# Altium project ESP32.PrjPcb
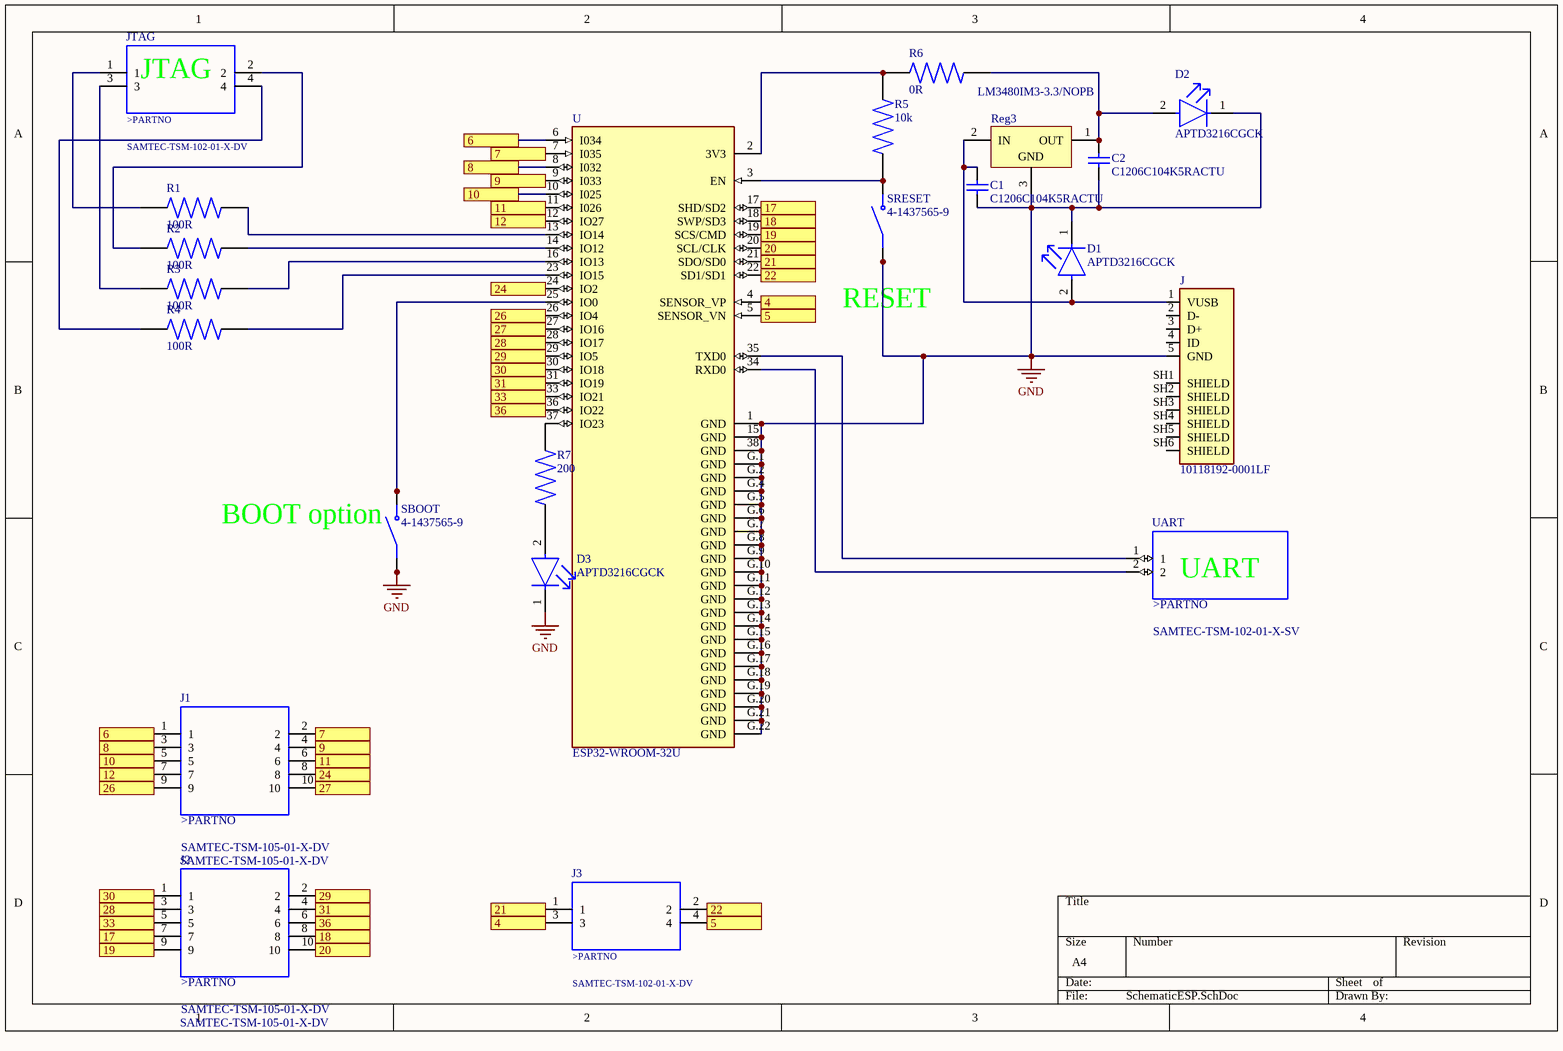
[diagram p0: SchematicESP.SchDoc]
1 sheet, 22 parts. Net scope: flat (ports and power ports of the same name join across sheets).
Board file: PCB1.PcbDoc

## Sheet SchematicESP.SchDoc
size A4; SheetNumber: 1; SheetTotal: 1

### Parts
C1  C1206C104K5RACTU  [KEMT-1206-2_M]
C2  C1206C104K5RACTU  [KEMT-1206-2_M]
D1  APTD3216CGCK  [FP-APTD3216CGCK-MFG]
D2  APTD3216CGCK  [FP-APTD3216CGCK-MFG]
D3  APTD3216CGCK  [FP-APTD3216CGCK-MFG]
J  10118192-0001LF  [AMPHENOL_10118192-0001LF]
J1  SAMTEC-TSM-105-01-X-DV  [SAMTEC-TSM-105-01-X-DV]
J2  SAMTEC-TSM-105-01-X-DV  [SAMTEC-TSM-105-01-X-DV]
J3  (no value)  [SAMTEC-TSM-102-01-X-DV]
JTAG  (no value)  [SAMTEC-TSM-102-01-X-DV]
R1  100R  [RESC3116X65N]
R2  100R  [RESC3116X65N]
R3  100R  [RESC3116X65N]
R4  100R  [RESC3116X65N]
R5  10k  [RESC3116X65N]
R6  0R  [RESC3116X65N]
R7  200  [RESC3116X65N]
Reg3  LM3480IM3-3.3/NOPB  [DBZ0003A_M]
SBOOT  4-1437565-9  [SW_4-1437565-9]
SRESET  4-1437565-9  [SW_4-1437565-9]
U  ESP32-WROOM-32U  [XCVR_ESP32-WROOM-32U]
UART  (no value)  [SAMTEC-TSM-102-01-X-SV]

### Ports
4, 5, 6, 7, 8, 9, 10, 11, 12, 17, 18, 19, 20, 21, 22, 24, 26, 27, 28, 29, 30, 31, 33, 36

### Nets
GND: C1.1 C2.1 D1.1(C) D2.1(C) D3.1(C) J.5(GND) Reg3.3(GND) SBOOT.1(COM) SBOOT.2(COM) SRESET.1(COM) SRESET.2(COM) U.1(GND) U.15(GND) U.38(GND) U.G.1(GND) U.G.2(GND) U.G.4(GND) U.G.5(GND) U.G.6(GND) U.G.7(GND) U.G.8(GND) U.G.9(GND) U.G.10(GND) U.G.11(GND) U.G.12(GND) U.G.13(GND) U.G.14(GND) U.G.15(GND) U.G.16(GND) U.G.17(GND) U.G.18(GND) U.G.19(GND) U.G.20(GND) U.G.21(GND) U.G.22(GND)
NetC1_2: C1.2 D1.2(A) J.1(VUSB) Reg3.2(IN)
NetC2_2: C2.2 D2.2(A) R6.1 Reg3.1(OUT)
NetD3_2: D3.2(A) R7.1
NetJ1_1: J1.1 U.6(I034) ; port 6
NetJ1_2: J1.2 U.7(I035) ; port 7
NetJ1_3: J1.3 U.8(I032) ; port 8
NetJ1_4: J1.4 U.9(I033) ; port 9
NetJ1_5: J1.5 U.10(I025) ; port 10
NetJ1_6: J1.6 U.11(I026) ; port 11
NetJ1_7: J1.7 U.12(IO27) ; port 12
NetJ1_8: J1.8 U.24(IO2) ; port 24
NetJ1_9: J1.9 U.26(IO4) ; port 26
NetJ1_10: J1.10 U.27(IO16) ; port 27
NetJ2_1: J2.1 U.30(IO18) ; port 30
NetJ2_2: J2.2 U.29(IO5) ; port 29
NetJ2_3: J2.3 U.28(IO17) ; port 28
NetJ2_4: J2.4 U.31(IO19) ; port 31
NetJ2_5: J2.5 U.33(IO21) ; port 33
NetJ2_6: J2.6 U.36(IO22) ; port 36
NetJ2_7: J2.7 U.17(SHD/SD2) ; port 17
NetJ2_8: J2.8 U.18(SWP/SD3) ; port 18
NetJ2_9: J2.9 U.19(SCS/CMD) ; port 19
NetJ2_10: J2.10 U.20(SCL/CLK) ; port 20
NetJ3_1: J3.1 U.21(SDO/SD0) ; port 21
NetJ3_2: J3.2 U.22(SD1/SD1) ; port 22
NetJ3_3: J3.3 U.4(SENSOR_VP) ; port 4
NetJ3_4: J3.4 U.5(SENSOR_VN) ; port 5
NetJTAG_1: JTAG.1 R1.2
NetJTAG_2: JTAG.2 R2.2
NetJTAG_3: JTAG.3 R3.2
NetJTAG_4: JTAG.4 R4.2
NetR1_1: R1.1 U.13(IO14)
NetR2_1: R2.1 U.14(IO12)
NetR3_1: R3.1 U.16(IO13)
NetR4_1: R4.1 U.23(IO15)
NetR5_1: R5.1 SRESET.3(NO) SRESET.4(NO) U.3(EN)
NetR5_2: R5.2 R6.2 U.2(3V3)
NetR7_2: R7.2 U.37(IO23)
NetSBOOT_3: SBOOT.3(NO) SBOOT.4(NO) U.25(IO0)
NetU_34: U.34(RXD0) UART.2
NetU_35: U.35(TXD0) UART.1

Not connected (* = marked no-connect by the designer): J 2(D-) 3(D+) 4(ID) SH1(SHIELD) SH2(SHIELD) SH3(SHIELD) SH4(SHIELD) SH5(SHIELD) SH6(SHIELD)

### Notes on the sheet
- (near JTAG) JTAG
- (near SRESET) RESET
- (near SBOOT) BOOT option
- (near UART) UART
- (in symbol SAMTEC-TSM-102-01-X-DV) >PARTNO
- (in symbol SAMTEC-TSM-102-01-X-SV) >PARTNO
- (in symbol SAMTEC-TSM-105-01-X-DV) >PARTNO

### Library data of the parts
C1 C2 = CMP-1037-04202-2: CAP, Ceramic, 0.1 uF, +/- 10%, 50 V, -55 to 125 degC, 1206 (3216 Metric), RoHS, Tape and Reel; Manufacturer: Kemet; Voltage Rating: 50V; Capacitance: 0.1µF; Product Range: KEMET-CSeries; SVHC: ToBeAdvised; Dielectric Characteristic: X7R; Capacitor Case Style: 1206[3216Metric]; Package Reference: 1206-2; Package Description: 2-Leads SMD, Body 3.2 x 1.6 mm; Packaging: Tape&Reel; Operating Temperature Max: 125degC; Capacitance Tolerance: ±10%; Datasheet URL: https://datasheet.ciiva.com/6125/1725438-6125494.pdf; Manufacturer URL: http://www.kemet.com/; Operating Temperature Min: -55degC; Datasheet Version: Jul-13
D1-D3 = CMP-2000-05792-2: LED GREEN CLEAR 2SMD; Forward Voltage: 2.1V; Forward Current: 20mA; Luminous Intensity: 300mcd; Number of LEDs: 1; Dominant Wavelength: 570nm; Viewing Angle: 50°; Lead Free: Lead Free; Lens Color: Clear; Mount: Surface Mount; Package Quantity: 2000; Height: 1.8mm; Number of Pins: 2; Test Current: 20mA; Case Code (Metric): 3216; Case/Package: 1206; Case Code (Imperial): 1206; Illumination Color: Green; Color: Green; Width: 1.6mm; Packaging: Tape and Reel; Min Operating Temperature: -40°C; Lens Style: Clear; Max Operating Temperature: 85°C; Length: 3.2mm
J = 10118192-0001LF: USB - micro B USB 2.0 Receptacle Connector 5 Position Surface Mount, Right Angle; MF: Amphenol ICC; Availability: Unavailable; Price: None; Package: None; MP: 10118192-0001LF; Value: *; SnapEDA_Link: https://www.snapeda.com/parts/10118192-0001LF/Amphenol%20FCI/view-part/2897676/?ref=snap
J1 J2 = SAMTEC-TSM-105-01-X-DV: TSM Series .100 Surface Mount Terminal Strip; MF: Samtec Inc.; MP: TSM-105-01-F-DV; Digi-Key_Purchase_URL: https://www.digikey.com/product-detail/en/samtec-inc/TSM-105-01-F-DV-001/TSM-105-01-F-DV-001-ND/7637717?utm_source=snapeda&utm_medium=aggregator&utm_campaign=symbol; Digi-Key_Part_Number: TSM-105-01-F-DV-001-ND; SnapEDA_Link: https://www.snapeda.com/parts/TSM-105-01-F-DV/Samtec%20Inc./view-part/2802977/?ref=snap; Package: None; Value: *
J3 JTAG = SAMTEC-TSM-102-01-X-DV: TSM Series .100 Surface Mount Terminal Strip; MF: Samtec; MP: TSM-102-01-F-DV; Value: *; SnapEDA_Link: https://www.snapeda.com/parts/TSM-102-01-F-DV/Samtec%20Inc./view-part/2805976/?ref=snap; Package: None; Digi-Key_Part_Number: TSM-102-01-F-DV-ND; Digi-Key_Purchase_URL: https://www.digikey.com/product-detail/en/samtec-inc/TSM-102-01-F-DV/TSM-102-01-F-DV-ND/7623428?utm_source=snapeda&utm_medium=aggregator&utm_campaign=symbol
R1-R7 = RC1206JR-0713RL: 13 Ohms Â±5% 0.25W, 1/4W Chip Resistor 1206 _3216 Metric_ Moisture Resistant Thick Film; MF: Yageo; MP: RC1206JR-0713RL; Availability: Unavailable; SnapEDA_Link: https://www.snapeda.com/parts/RC1206JR-0713RL/Yageo/view-part/105893/?ref=snap; Package: 3116 Yageo; Value: *; Price: None
Reg3 = CMP-0062-02202-3: 100 mA, Quasi Low-Dropout Linear Voltage Regulator, 3-pin SOT-23, Pb-Free; Manufacturer: Texas Instruments; CompType: LDO IC; PackageTopMarking: L0A*XTT; PowerWise: N; PackageDescription: Molded SOT-23, .115 x .051 x .037in Body, 3 Lead, .075 in Pitch; PackageReference: DBZ0003A; RoHS: Y; ComponentLink1URL: http://www.ti.com/general/docs/lit/getliterature.tsp?genericPartNumber=LM3480&fileType=pdf; PinCount: 3; ComponentLink1Description: Datasheet URL
SBOOT SRESET = 4-1437565-9: Tactile Switch SPST-NO Top Actuated Surface Mount; Configuration_Pole-Throw: Single Pole - Single Throw; Contact_Current_Rating: 50 mA; MF: TE Connectivity; Availability: Warning; Value: *; Package: None; Price: None; SnapEDA_Link: https://www.snapeda.com/parts/4-1437565-9/TE%20Connectivity%20ALCOSWITCH%20Switches/view-part/304397/?ref=snap; Purchase-URL: https://pricing.snapeda.com/search/part/4-1437565-9/?ref=eda; MP: 4-1437565-9; EU_RoHS_Compliance: Compliant
U = ESP32-WROOM-32U: Bluetooth, WiFi 802.11b/g/n, Bluetooth v4.2 +EDR, Class 1, 2 and 3 Transceiver Module 2.4GHz ~ 2.5GHz Antenna Not Included, U.FL Surface Mount; MF: Espressif Systems; Value: *; SnapEDA_Link: https://www.snapeda.com/parts/ESP32-WROOM-32U/Espressif%20Systems/view-part/2472476/?ref=snap; Availability: Unavailable; Price: None; DigiKey-Purchase-URL: https://snapeda.com/shop?store=DigiKey&id=2472476; Package: Module Espressif Systems; MP: ESP32-WROOM-32U
UART = SAMTEC-TSM-102-01-X-SV: Steckverbinder-Header-OberflÃ¤chenmontage 2 Position 2,54 mm (0,100 ); MF: Samtec; MP: TSM-102-01-T-SV-TR; Toby_UK-Purchase-URL: https://snapeda.com/shop?store=Toby+UK&id=2803555; Package: None; SnapEDA_Link: https://www.snapeda.com/parts/TSM-102-01-T-SV-TR/Samtec%20Inc./view-part/2803555/?ref=snap; Value: *; Digi-Key_Part_Number: SAM14779CT-ND